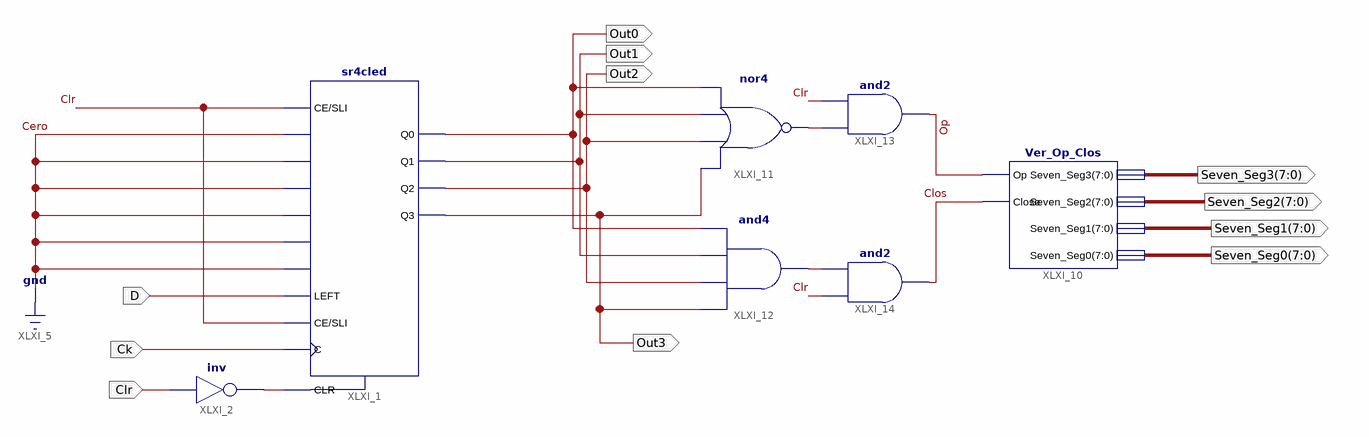
[diagram p0: schematic sheet 1]
// Xilinx ISE schematic Door_SMD.sch (spartan6) as structural Verilog: 7 symbols, 11 ports
module Door_SMD (
  input  Clr,
  input  Ck,
  input  D,
  output [7:0] Seven_Seg3,
  output [7:0] Seven_Seg2,
  output [7:0] Seven_Seg1,
  output [7:0] Seven_Seg0,
  output Out0,
  output Out1,
  output Out2,
  output Out3
);

  wire Clos, Op, XLXN_1, XLXN_64, XLXN_65;

  Ver_Op_Clos XLXI_10 (
    .Close(Clos), .Op(Op), .Seven_Seg0(Seven_Seg0), .Seven_Seg1(Seven_Seg1), .Seven_Seg2(Seven_Seg2),
    .Seven_Seg3(Seven_Seg3));
  and XLXI_13 (Op, XLXN_64, Clr);
  and XLXI_14 (Clos, Clr, XLXN_65);
  not XLXI_2 (XLXN_1, Clr);
  sr4cled XLXI_1 (
    .C(Ck), .CE(Clr), .CLR(XLXN_1), .D0(1'b0), .D1(1'b0), .D2(1'b0), .D3(1'b0), .L(1'b0), .LEFT(D),
    .SLI(Clr), .SRI(1'b0), .Q0(Out0), .Q1(Out1), .Q2(Out2), .Q3(Out3));
  nor XLXI_11 (XLXN_64, Out3, Out2, Out1, Out0);
  and XLXI_12 (XLXN_65, Out3, Out2, Out1, Out0);
endmodule
